# EAGLE design BTS and Arduino UNO Shield (EAGLE 9.6.2)
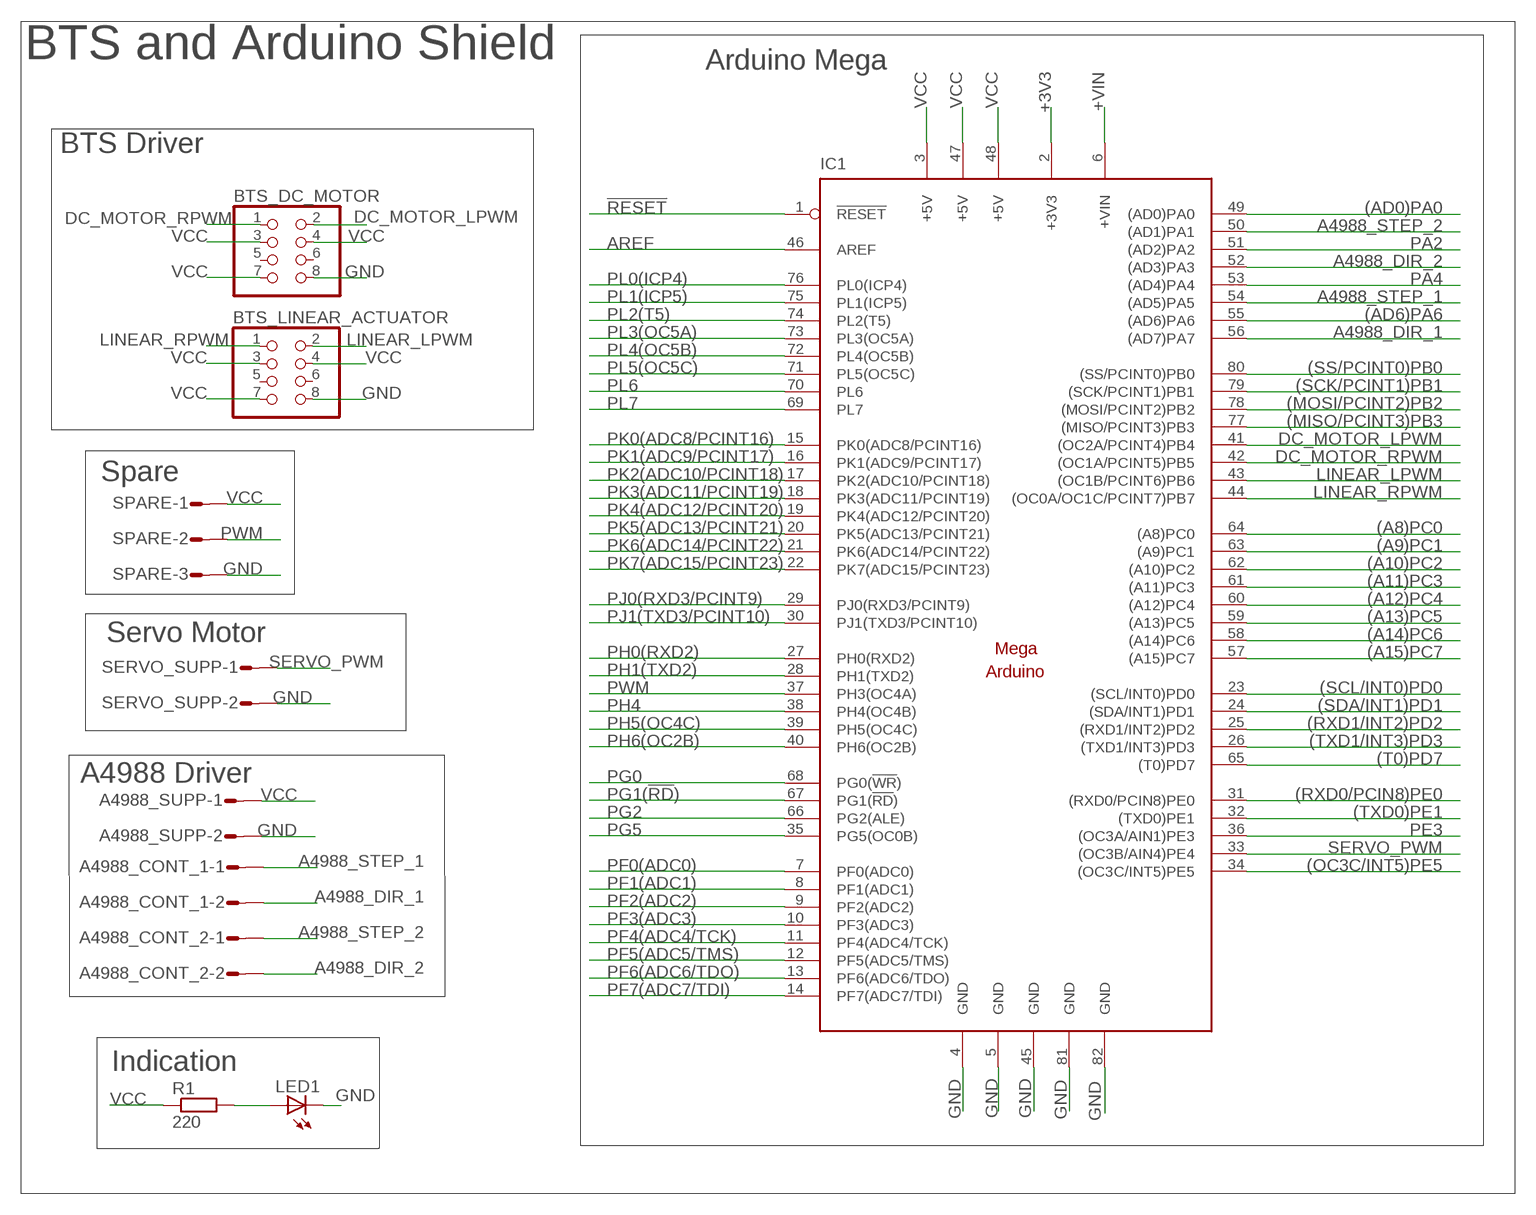
[diagram p0: schematic, sheet 1]

## Parts
A4988_CONT_1  CON-AMP-MT_S02P  [CON-AMP-MT_S02P]
A4988_CONT_2  CON-AMP-MT_S02P  [CON-AMP-MT_S02P]
A4988_SUPP  CON-AMP-MT_S02P  [CON-AMP-MT_S02P]
BTS_DC_MOTOR  PINHD-2X4  [2X04]
BTS_LINEAR_ACTUATOR  PINHD-2X4  [2X04]
IC1  MEGAARDUINO_1  [MEGA_ARDUINO]
LED1  LED_LED3MM  [LED_LED3MM]
R1  220  RCL_R-EU_0204/7  [RCL_0204/7]
SERVO_SUPP  CON-AMP-MT_S02P  [CON-AMP-MT_S02P]
SPARE  CON-AMP-MT_S03P  [CON-AMP-MT_S03P]

## Nets
!RESET: IC1.1(!RESET)
(A8)PC0: IC1.64((A8)PC0)
(A9)PC1: IC1.63((A9)PC1)
(A10)PC2: IC1.62((A10)PC2)
(A11)PC3: IC1.61((A11)PC3)
(A12)PC4: IC1.60((A12)PC4)
(A13)PC5: IC1.59((A13)PC5)
(A14)PC6: IC1.58((A14)PC6)
(A15)PC7: IC1.57((A15)PC7)
(AD0)PA0: IC1.49((AD0)PA0)
(AD6)PA6: IC1.55((AD6)PA6)
(MISO/PCINT3)PB3: IC1.77((MISO/PCINT3)PB3)
(MOSI/PCINT2)PB2: IC1.78((MOSI/PCINT2)PB2)
(OC3C/INT5)PE5: IC1.34((OC3C/INT5)PE5)
(RXD0/PCIN8)PE0: IC1.31((RXD0/PCIN8)PE0)
(RXD1/INT2)PD2: IC1.25((RXD1/INT2)PD2)
(SCK/PCINT1)PB1: IC1.79((SCK/PCINT1)PB1)
(SCL/INT0)PD0: IC1.23((SCL/INT0)PD0)
(SDA/INT1)PD1: IC1.24((SDA/INT1)PD1)
(SS/PCINT0)PB0: IC1.80((SS/PCINT0)PB0)
(T0)PD7: IC1.65((T0)PD7)
(TXD0)PE1: IC1.32((TXD0)PE1)
(TXD1/INT3)PD3: IC1.26((TXD1/INT3)PD3)
+3V3: IC1.2(+3V3)
+VIN: IC1.6(+VIN)
A4988_DIR_1: A4988_CONT_1.2 IC1.56((AD7)PA7)
A4988_DIR_2: A4988_CONT_2.2 IC1.52((AD3)PA3)
A4988_STEP_1: A4988_CONT_1.1 IC1.54((AD5)PA5)
A4988_STEP_2: A4988_CONT_2.1 IC1.50((AD1)PA1)
AREF: IC1.46(AREF)
DC_MOTOR_LPWM: BTS_DC_MOTOR.2 IC1.41((OC2A/PCINT4)PB4)
DC_MOTOR_RPWM: BTS_DC_MOTOR.1 IC1.42((OC1A/PCINT5)PB5)
GND: A4988_SUPP.2 BTS_DC_MOTOR.8 BTS_LINEAR_ACTUATOR.8 IC1.4(GND) IC1.5(GND) IC1.45(GND) IC1.81(GND) IC1.82(GND) LED1.K(C) SERVO_SUPP.2 SPARE.3
LINEAR_LPWM: BTS_LINEAR_ACTUATOR.2 IC1.43((OC1B/PCINT6)PB6)
LINEAR_RPWM: BTS_LINEAR_ACTUATOR.1 IC1.44((OC0A/OC1C/PCINT7)PB7)
N$1: LED1.A R1.2
PA2: IC1.51((AD2)PA2)
PA4: IC1.53((AD4)PA4)
PE3: IC1.36((OC3A/AIN1)PE3)
PF0(ADC0): IC1.7(PF0(ADC0))
PF1(ADC1): IC1.8(PF1(ADC1))
PF2(ADC2): IC1.9(PF2(ADC2))
PF3(ADC3): IC1.10(PF3(ADC3))
PF4(ADC4/TCK): IC1.11(PF4(ADC4/TCK))
PF5(ADC5/TMS): IC1.12(PF5(ADC5/TMS))
PF6(ADC6/TDO): IC1.13(PF6(ADC6/TDO))
PF7(ADC7/TDI): IC1.14(PF7(ADC7/TDI))
PG0: IC1.68(PG0(!WR!))
PG1(!RD!): IC1.67(PG1(!RD!))
PG2: IC1.66(PG2(ALE))
PG5: IC1.35(PG5(OC0B))
PH0(RXD2): IC1.27(PH0(RXD2))
PH1(TXD2): IC1.28(PH1(TXD2))
PH4: IC1.38(PH4(OC4B))
PH5(OC4C): IC1.39(PH5(OC4C))
PH6(OC2B): IC1.40(PH6(OC2B))
PJ0(RXD3/PCINT9): IC1.29(PJ0(RXD3/PCINT9))
PJ1(TXD3/PCINT10): IC1.30(PJ1(TXD3/PCINT10))
PK0(ADC8/PCINT16): IC1.15(PK0(ADC8/PCINT16))
PK1(ADC9/PCINT17): IC1.16(PK1(ADC9/PCINT17))
PK2(ADC10/PCINT18): IC1.17(PK2(ADC10/PCINT18))
PK3(ADC11/PCINT19): IC1.18(PK3(ADC11/PCINT19))
PK4(ADC12/PCINT20): IC1.19(PK4(ADC12/PCINT20))
PK5(ADC13/PCINT21): IC1.20(PK5(ADC13/PCINT21))
PK6(ADC14/PCINT22): IC1.21(PK6(ADC14/PCINT22))
PK7(ADC15/PCINT23): IC1.22(PK7(ADC15/PCINT23))
PL0(ICP4): IC1.76(PL0(ICP4))
PL1(ICP5): IC1.75(PL1(ICP5))
PL2(T5): IC1.74(PL2(T5))
PL3(OC5A): IC1.73(PL3(OC5A))
PL4(OC5B): IC1.72(PL4(OC5B))
PL5(OC5C): IC1.71(PL5(OC5C))
PL6: IC1.70(PL6)
PL7: IC1.69(PL7)
PWM: IC1.37(PH3(OC4A)) SPARE.2
SERVO_PWM: IC1.33((OC3B/AIN4)PE4) SERVO_SUPP.1
VCC: A4988_SUPP.1 BTS_DC_MOTOR.3 BTS_DC_MOTOR.4 BTS_DC_MOTOR.7 BTS_LINEAR_ACTUATOR.3 BTS_LINEAR_ACTUATOR.4 BTS_LINEAR_ACTUATOR.7 IC1.3(+5V) IC1.47(+5V) IC1.48(+5V) R1.1 SPARE.1
Unconnected: BTS_DC_MOTOR.5 BTS_DC_MOTOR.6 BTS_LINEAR_ACTUATOR.5 BTS_LINEAR_ACTUATOR.6

## Notes on the sheet
- BTS and Arduino Shield
- Arduino Mega
- BTS Driver
- Spare
- Servo Motor
- A4988 Driver
- Indication

## Library data of the parts
A4988_CONT_1 A4988_CONT_2 A4988_SUPP SERVO_SUPP = MindCloud:CON-AMP-MT_S02P: AMP MT CONNECTOR; OC_FARNELL: unknown; OC_NEWARK: unknown
BTS_DC_MOTOR BTS_LINEAR_ACTUATOR = pinhead:PINHD-2X4: PIN HEADER
IC1 = MindCloud:MEGAARDUINO_1: The Arduino Mega is a microcontroller board based on the ATmega1280. - 54 digital input/output pins (of which 14 can be used as PWM outputs) - 16 analog inputs - 4 UARTs (hardware serial ports) - 16 MHz crystal oscillator - USB connection - power jack - ICSP header - reset button It contains everything needed to support the microcontroller; simply connect it to a computer with a USB cable or power it with a AC-to-DC adapter or battery to get started. The Mega is compatible with most shields designed for the Arduino Duemilanove or Diecimila. http://arduino.cc/en/Main/ArduinoBoardMega
LED1 = MindCloud:LED_LED: LED OSRAM: - CHIPLED LG R971, LG N971, LY N971, LG Q971, LY Q971, LO R971, LY R971 LH N974, LH R974 LS Q976, LO Q976, LY Q976 LO Q996 - Hyper CHIPLED LW Q18S LB Q993, LB Q99A, LB R99A - SideLED LS A670, LO A670, LY A670, LG A670, LP A670 LB A673, LV A673, LT A673, LW A673 LH A674 LY A675 LS A676, LA A676, LO A676, LY A676, LW A676 LS A679, LY A679, LG A679 - Hyper Micro SIDELED® LS Y876, LA Y876, LO Y876, LY Y876 LT Y87S - SmartLED LW L88C, LW L88S LB L89C, LB L89S, LG L890 LS L89K, LO L89K, LY L89K LS L896, LA L896, LO L896, LY L896 - TOPLED LS T670, LO T670, LY T670, LG T670, LP T670 LSG T670, LSP T670, LSY T670, LOP T670, LYG T670 LG T671, LOG T671, LSG T671 LB T673, LV T673, LT T673, LW T673 LH T674 LS T676, LA T676, LO T676, LY T676, LB T676, LH T676, LSB T676, LW T676 LB T67C, LV T67C, LT T67C, LS T67K, LO T67K, LY T67K, LW E67C LS E67B, LA E67B, LO E67B, LY E67B, LB E67C, LV E67C, LT E67C LW T67C LS T679, LY T679, LG T679 LS T770, LO T770, LY T770, LG T770, LP T770 LB T773, LV T773, LT T773, LW T773 LH T774 LS E675, LA E675, LY E675, LS T675 LS T776, LA T776, LO T776, LY T776, LB T776 LHGB T686 LT T68C, LB T68C - Hyper Mini TOPLED® LB M676 - Mini TOPLED Santana® LG M470 LS M47K, LO M47K, LY M47K Source: http://www.osram.convergy.de LUXEON: - LUMILED® LXK2-PW12-R00, LXK2-PW12-S00, LXK2-PW14-U00, LXK2-PW14-V00 LXK2-PM12-R00, LXK2-PM12-S00, LXK2-PM14-U00 LXK2-PE12-Q00, LXK2-PE12-R00, LXK2-PE12-S00, LXK2-PE14-T00, LXK2-PE14-U00 LXK2-PB12-K00, LXK2-PB12-L00, LXK2-PB12-M00, LXK2-PB14-N00, LXK2-PB14-P00, LXK2-PB14-Q00 LXK2-PR12-L00, LXK2-PR12-M00, LXK2-PR14-Q00, LXK2-PR14-R00 LXK2-PD12-Q00, LXK2-PD12-R00, LXK2-PD12-S00 LXK2-PH12-R00, LXK2-PH12-S00 LXK2-PL12-P00, LXK2-PL12-Q00, LXK2-PL12-R00 Source: www.luxeon.com KINGBRIGHT: KA-3528ASYC Source: www.kingbright.com
R1 = MindCloud:RCL_R-EU_: RESISTOR, European symbol; SPICEPREFIX: R
SPARE = MindCloud:CON-AMP-MT_S03P: AMP MT CONNECTOR; OC_FARNELL: unknown; OC_NEWARK: unknown

## Board
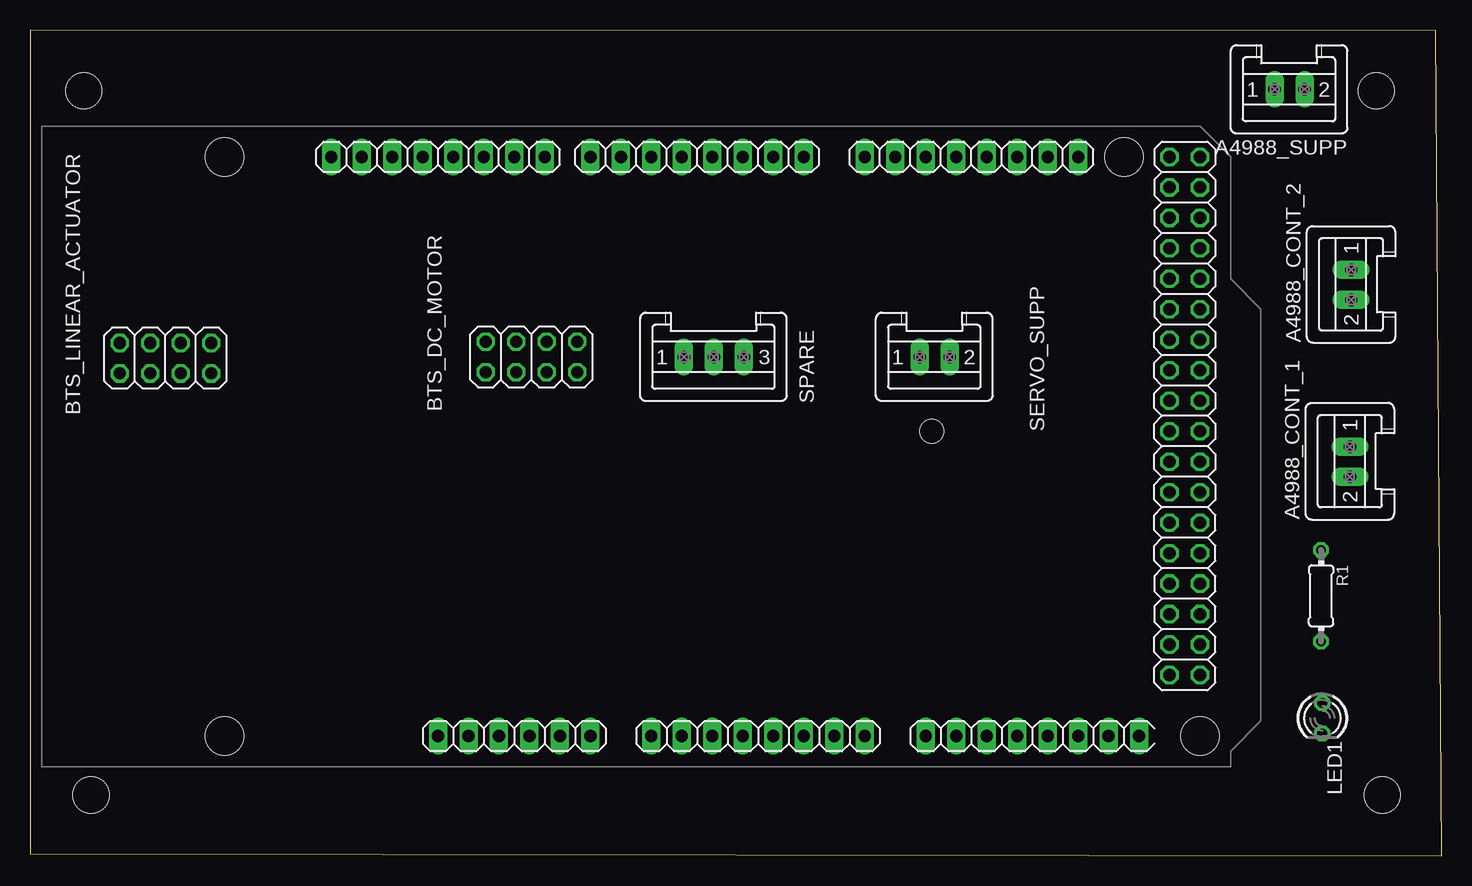
[diagram p1: board, top side]
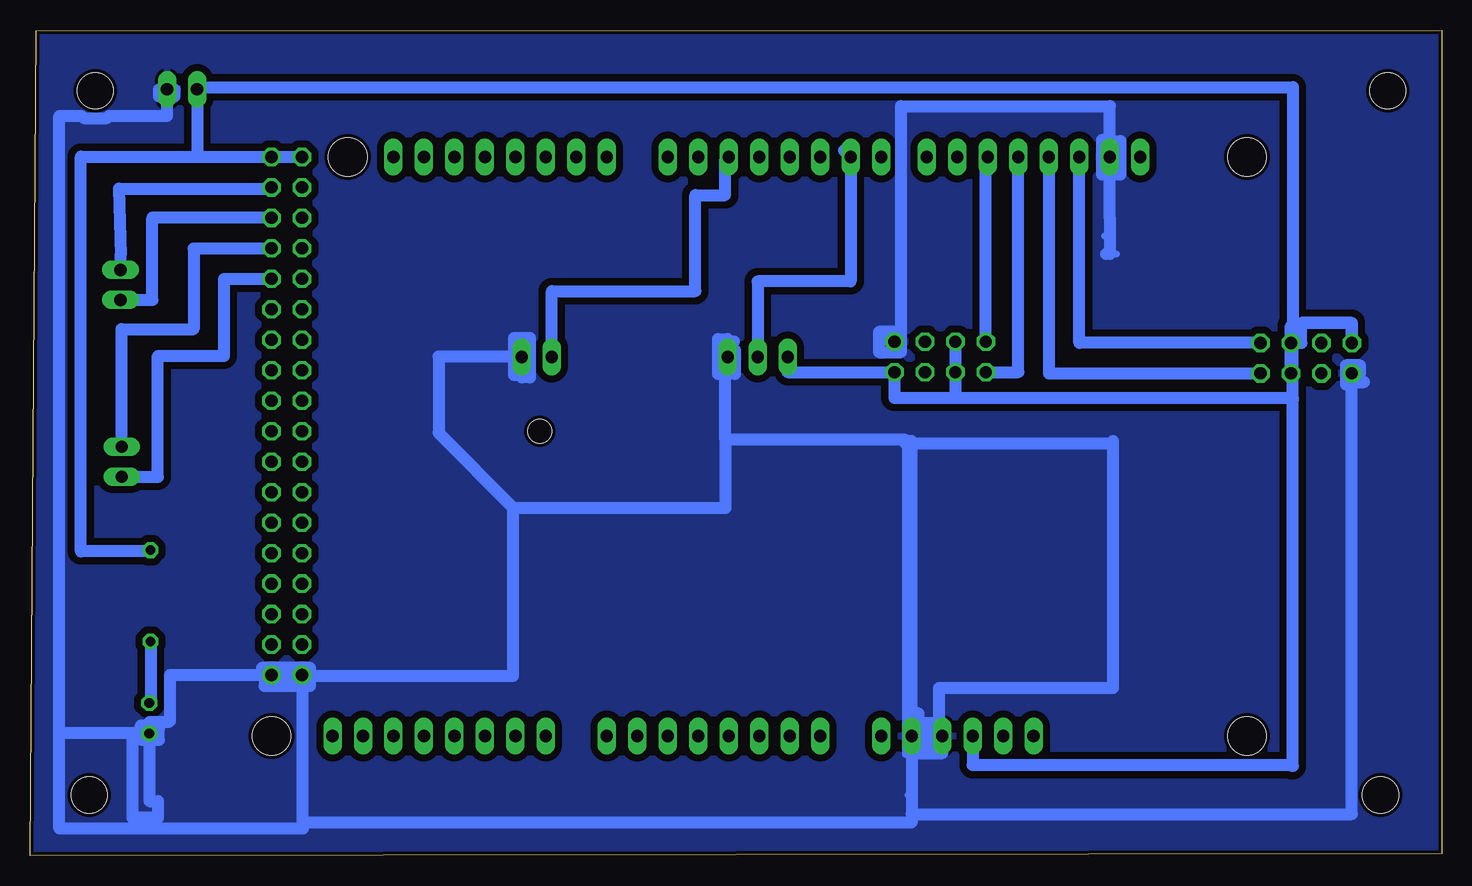
[diagram p2: board, bottom side, seen from below]

Size 117.63 x 68.79 mm. Coordinates in mm from the lower left corner, seen from the top.
Outline: 0,0.16 117.63,0 117.13,68.73 0,68.79 0,0.16
Copper layers (1*16): Top 0.035mm / dielectric 1.5mm / Bottom 0.035mm
Design rules "default *": minimum track width 0.3mm, minimum drill 0.35mm, track to track 0.6mm, track to pad 0.3mm, pad to pad 0.3mm, via to via 0.3mm, smd to smd 0.3mm, copper to edge 0.3mm, drill to drill 0.3mm, minimum pad ring 10mil, minimum via ring 8mil, stop-mask expansion 4mil, vias tented up to drill 0mil, thermal gap 10mil
Holes 3 mm at 4.49,63.74 5.09,5.04 112.69,5.04 112.19,63.74

### Footprints (pad centres in the part's own frame; a part is rotated, then mirrored left to right if it is on the bottom)
CON-AMP-MT_S02P = drill 1.016 long: 1 1.25,0; 2 -1.25,0
2X04 = drill 1.016 octagon: 1 -3.81,-1.27; 2 -3.81,1.27; 3 -1.27,-1.27; 4 -1.27,1.27; 5 1.27,-1.27; 6 1.27,1.27; 7 3.81,-1.27; 8 3.81,1.27
MEGA_ARDUINO = drill 1.016 long: 1 33.02,2.54; 2 35.56,2.54; 3 38.1,2.54; 4 40.64,2.54; 5 43.18,2.54; 6 45.72,2.54; 7 50.8,2.54; 8 53.34,2.54; 9 55.88,2.54; 10 58.42,2.54; 11 60.96,2.54; 12 63.5,2.54; 13 66.04,2.54; 14 68.58,2.54; 15 73.66,2.54; 16 76.2,2.54; 17 78.74,2.54; 18 81.28,2.54; 19 83.82,2.54; 20 86.36,2.54; 21 88.9,2.54; 22 91.44,2.54; 23 86.36,50.8; 24 83.82,50.8; 25 81.28,50.8; 26 78.74,50.8; 27 76.2,50.8; 28 73.66,50.8; 29 71.12,50.8; 30 68.58,50.8; 31 63.5,50.8; 32 60.96,50.8; 33 58.42,50.8; 34 55.88,50.8; 35 53.34,50.8; 36 50.8,50.8; 37 48.26,50.8; 38 45.72,50.8; 39 41.91,50.8; 40 39.37,50.8; 41 36.83,50.8; 42 34.29,50.8; 43 31.75,50.8; 44 29.21,50.8; 45 26.67,50.8; 46 24.13,50.8 | drill 1.016 octagon: 47 93.98,50.8; 48 96.52,50.8; 49 93.98,48.26; 50 96.52,48.26; 51 93.98,45.72; 52 96.52,45.72; 53 93.98,43.18; 54 96.52,43.18; 55 93.98,40.64; 56 96.52,40.64; 57 93.98,38.1; 58 96.52,38.1; 59 93.98,35.56; 60 96.52,35.56; 61 93.98,33.02; 62 96.52,33.02; 63 93.98,30.48; 64 96.52,30.48; 65 93.98,27.94; 66 96.52,27.94; 67 93.98,25.4; 68 96.52,25.4; 69 93.98,22.86; 70 96.52,22.86; 71 93.98,20.32; 72 96.52,20.32; 73 93.98,17.78; 74 96.52,17.78; 75 93.98,15.24; 76 96.52,15.24; 77 93.98,12.7; 78 96.52,12.7; 79 93.98,10.16; 80 96.52,10.16; 81 93.98,7.62; 82 96.52,7.62 | hole 3.2: 15.24,50.8; 15.24,2.54; 90.17,50.8; 96.52,2.54 | hole 2: 74.168,27.94
LED_LED3MM = drill 0.813 octagon: A -1.27,0; K 1.27,0
RCL_0204/7 = drill 0.813 octagon: 1 -3.81,0; 2 3.81,0
CON-AMP-MT_S03P = drill 1.016 long: 1 2.5,0; 2 0,0; 3 -2.5,0

### Placement (x,y rotation side)
A4988_CONT_1  109.99,32.81 90 top
A4988_CONT_2  110.09,47.55 90 top
A4988_SUPP  104.96,63.85 180 top
BTS_DC_MOTOR  41.79,41.55 0 top
BTS_LINEAR_ACTUATOR  11.29,41.45 180 top
IC1  0.98,7.42 0 top
LED1  107.69,11.44 270 top
R1  107.59,21.64 270 top
SERVO_SUPP  75.4,41.55 180 top
SPARE  57,41.55 180 top

### Tracks (layer width: path | path; a pad name or v marks a point on that pad's centre or on a via)
A4988_DIR_1
  Bottom 0.6: 108.85,31.54 A4988_CONT_1.2
  Bottom 1: IC1.56 101.49,48.06 101.49,41.64 106.99,41.64 106.99,31.56 A4988_CONT_1.2
A4988_DIR_2
  Bottom 1: IC1.52 107.42,53.14 107.43,53.16 107.43,46.3 A4988_CONT_2.2
A4988_STEP_1
  Bottom 1: A4988_CONT_1.1 109.99,43.86 103.99,43.86 103.99,50.6 IC1.54
A4988_STEP_2
  Bottom 0.6: 97.5,55.58 IC1.50
  Bottom 1: A4988_CONT_2.1 110.09,50.02 110.22,55.58 97.5,55.58
DC_MOTOR_LPWM
  Bottom 1: BTS_DC_MOTOR.2 37.98,58.22 IC1.41
DC_MOTOR_RPWM
  Bottom 1: 37.81,40.34 BTS_DC_MOTOR.1 35.27,40.28 IC1.42
GND
  Bottom 0.6: 44.16,8.44 44.16,5.04 44.46,5.04 | 44.66,8.44 44.66,34.34 44.66,34.54 43.99,34.54 27.39,34.54 | 27.99,51.62 28.09,51.62 | 97.99,15.04 98.69,15.04 | 27.65,58.24 IC1.45 | 27.99,50.14 27.28,50.14 27.09,50.14 | 41.62,9.14 41.62,9.64 IC1.4 | IC1.81 96.99,15.04 | IC1.81 96.29,15.04 | IC1.81 97.99,15.04 | 97.99,15.04 98.59,15.04 | IC1.81 94.96,12.38 | IC1.81 94.89,14.96 94.89,14.94 94.89,9.04
  Bottom 1: IC1.45 27.65,53.08 27.65,50.14 27.99,50.14 | IC1.45 27.28,58.22 | LED1.K 107.69,9.64 | 107.69,9.64 107.69,4.54 106.99,4.54 106.99,3.14 109.09,3.14 109.09,10.17 LED1.K | A4988_SUPP.2 106.89,63.85 106.89,63.24 105.59,63.24 105.59,63.85 A4988_SUPP.2 | IC1.45 27.65,59.64 28.29,59.64 28.29,59.54 26.78,59.54 26.78,56.74 28.29,56.74 28.29,59.44 27.65,59.44 IC1.45 | 41.89,11.34 41.89,13.94 27.39,13.94 27.39,34.54 27.39,34.34 44.66,34.34 | 41.89,11.34 41.89,9.64 41.62,9.64 | IC1.45 27.65,62.44 45.04,62.44 45.04,41.94 46.89,41.94 46.89,43.64 45.6,43.64 BTS_DC_MOTOR.8 | SERVO_SUPP.2 83.57,41.55 83.59,41.57 83.59,35.24 77.3,28.96 77.3,28.94 | 59.69,34.64 44.66,34.64 44.66,34.54 44.16,34.54 44.16,11.64 | 59.69,34.64 59.69,41.55 SPARE.3 59.5,42.14 | 59.69,34.64 59.69,28.94 77.3,28.94 | 77.3,28.94 77.39,28.94 77.39,14.94 94.89,14.94 94.89,2.74 | 97.99,15.04 IC1.82 98.09,15.04 98.09,14.14 94.29,14.14 94.29,15.64 98.29,15.64 | 97.99,15.04 105.99,15.04 105.99,11.21 106.09,11.11 107.69,11.11 LED1.K | LED1.K 107.69,9.64 | LED1.K 115.19,10.17 | 115.19,10.17 115.19,61.64 113.34,61.64 113.14,61.44 111.23,61.44 111.03,61.64 106.21,61.64 A4988_SUPP.2 | 6.49,39.44 7.48,39.44 BTS_LINEAR_ACTUATOR.8 6.79,40.18 6.79,40.84 7.99,40.84 7.99,39.24 7.48,39.24 7.48,3.44 44.16,3.44 | 44.16,10.14 44.16,11.04 | 44.16,11.04 44.16,11.64 | IC1.5 41.89,9.96 41.89,11.34 | 43.69,11.04 41.62,11.04 IC1.4 41.62,9.34 44.16,9.34 44.16,10.14 | 43.69,11.04 44.16,11.04 | IC1.5 44.16,8.44 | IC1.5 44.16,8.54 41.59,8.54 | 44.16,10.14 44.16,11.64 | IC1.5 43.29,9.96 43.29,10.54 42.39,10.54 42.39,11.04 43.69,11.04 | IC1.5 43.59,9.96 43.59,11.84 44.16,11.84 44.16,10.14
  Bottom 1: IC1.81 97.99,15.04 | LED1.K 108.39,10.17 108.39,10.84 108.29,10.84 108.29,9.64 106.89,9.64 106.89,10.54 107.69,10.54 LED1.K | SERVO_SUPP.2 76.65,40.04 77.29,40.04 77.29,43.14 75.99,43.14 75.99,39.84 76.65,39.84 SERVO_SUPP.2 | 59.5,42.14 59.5,42.84 58.99,42.84 | 59.5,42.14 59.5,43.04 60.29,43.04 60.29,40.14 58.89,40.14 58.89,42.14 59.5,42.14 | 94.89,2.74 94.89,2.24 115.19,2.24 115.19,10.17 | IC1.5 44.16,3.44 | 44.16,3.44 44.16,2.74 94.89,2.74
  pour Bottom: -5.67,72.28 123.02,72.28 123.02,-1.89 -5.67,-1.89
LINEAR_LPWM
  Bottom 1: BTS_LINEAR_ACTUATOR.2 32.73,40.18 IC1.43
LINEAR_RPWM
  Bottom 1: BTS_LINEAR_ACTUATOR.1 30.19,42.72 IC1.44
N$1
  Bottom 1: R1.2 107.59,12.81 LED1.A
PH4
  Bottom 0.6: 46.59,58.22 IC1.38
PWM
  Bottom 1: 49.79,58.76 IC1.37 49.24,47.84 57,47.84 SPARE.2
SERVO_PWM
  Bottom 1: 59.39,58.23 IC1.33 59.7,57.92 59.7,55.04 62.19,55.04 62.19,47.04 74.15,47.04 SERVO_SUPP.1
VCC
  Bottom 1: IC1.47 IC1.48 97.53,58.24 103.39,58.24 | 103.39,58.24 113.39,58.24 113.39,25.34 107.59,25.34 R1.1 | IC1.3 39.08,7.56 39.07,7.54 12.59,7.54 12.49,7.44 12.39,7.44 12.39,37.94 | 12.56,42.64 BTS_LINEAR_ACTUATOR.3 | BTS_LINEAR_ACTUATOR.3 BTS_LINEAR_ACTUATOR.4 12.56,42.84 | 12.56,42.84 12.56,44.14 | 12.39,37.94 12.39,44.14 | 103.39,58.24 103.71,58.24 A4988_SUPP.1 103.71,64.04 12.39,64.04 12.39,44.14 | 40.29,43.05 BTS_DC_MOTOR.4 BTS_DC_MOTOR.3 40.49,40.28 40.49,38.14 | 11.68,44.38 11.68,44.14 11.96,44.14 12.39,44.14 | 7.48,44.38 BTS_LINEAR_ACTUATOR.7 7.48,44.38 | 7.48,44.38 11.68,44.38 | 40.49,38.14 45.6,38.14 BTS_DC_MOTOR.7 54.5,40.28 SPARE.1 | 40.49,38.14 12.39,38.14 12.39,37.94 | BTS_LINEAR_ACTUATOR.3 12.56,42.84 | BTS_LINEAR_ACTUATOR.3 11.68,42.72 11.68,44.38 | 11.68,44.38 7.48,44.38

### Text on the board
Document: VCC | GND | STEP | VCC | PWM | GND | Servo_PWM | GND | VCC | R_IS | R_EN | DIR | R_PWM | L_PWM | L_EN | L_IS | GND | R_PWM | R_EN | R_IS | VCC | GND | L_IS | L_EN | L_PWM | STEP | DIR | BTS and Arduino Shield